# Altium schematic sheet Sheet_1_2022-08-21.schdoc
size 321 x 219 mm
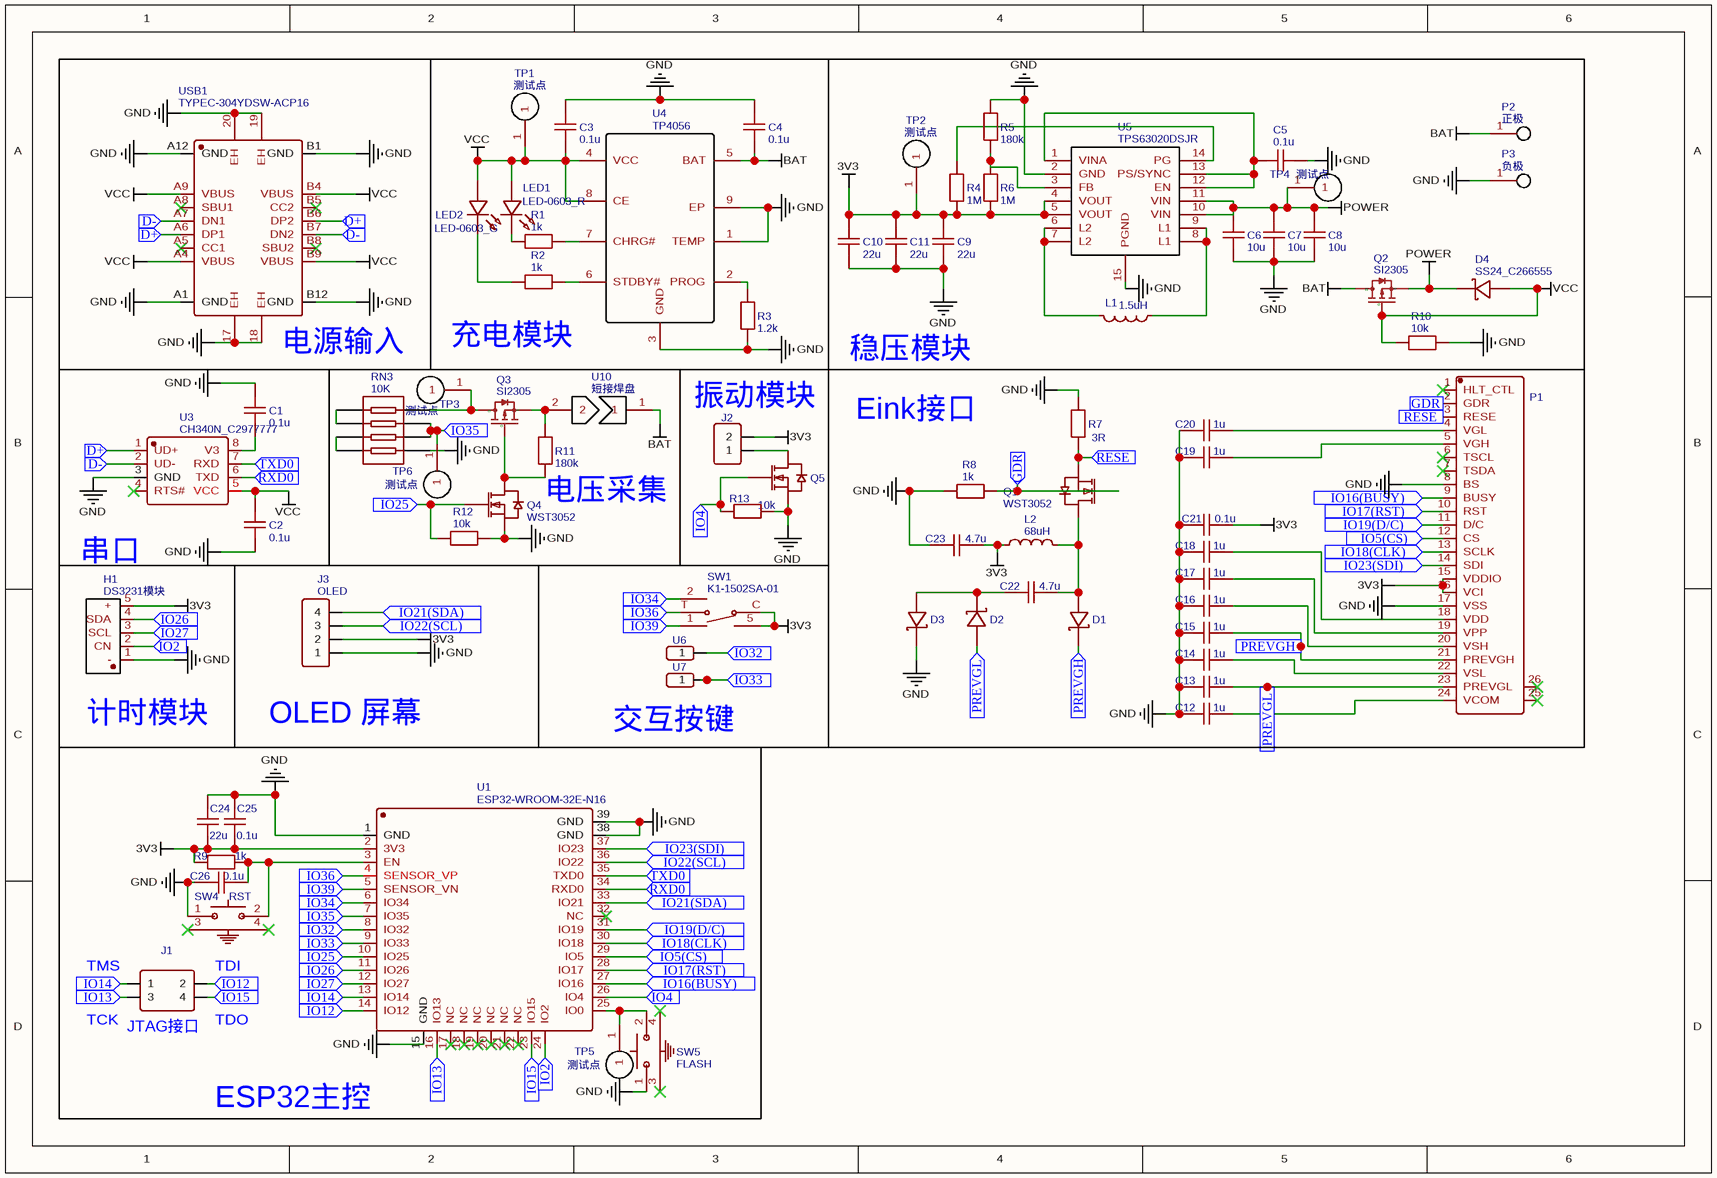
[diagram p0: Sheet_1_2022-08-21.schdoc]

## Parts
C1  0.1u  [C0603]
C2  0.1u  [C0603]
C3  0.1u  [C0603]
C4  0.1u  [C0603]
C5  0.1u  [C0603]
C6  10u  [C0603]
C7  10u  [C0603]
C8  10u  [C0603]
C9  22u  [C0603]
C10  22u  [C0603]
C11  22u  [C0603]
C12  1u  [C0603]
C13  1u  [C0603]
C14  1u  [C0603]
C15  1u  [C0603]
C16  1u  [C0603]
C17  1u  [C0603]
C18  1u  [C0603]
C19  1u  [C0603]
C20  1u  [C0603]
C21  0.1u  [C0603]
C22  4.7u  [C0603]
C23  4.7u  [C0603]
C24  22u  [C0603]
C25  0.1u  [C0603]
C26  0.1u  [C0603]
D1  MBR0530_C232832  [SOD-123_L2.8-W1.8-LS3.7-RD]  (value not drawn)
D2  MBR0530_C232832  [SOD-123_L2.8-W1.8-LS3.7-RD]  (value not drawn)
D3  MBR0530_C232832  [SOD-123_L2.8-W1.8-LS3.7-RD]  (value not drawn)
D4  SS24_C266555  [SMB_L4.6-W3.6-LS5.3-RD]
H1  DS3231模块  [DS3231模块]
J1  HDR-M-2.54_2x2  [HDR-M-2.54_2X2]  (value not drawn)
J2  HDR-M-2.54_1x2  [HDR-M-2.54_1X2]  (value not drawn)
J3  OLED  [HDR-M-2.54_1X4]
L1  1.5uH  [IND-SMD_L4.0-W4.0]
L2  68uH  [IND-SMD_L6.0-W6.0]
LED1  LED-0603_R  [LED0603_RED]
LED2  LED-0603_G  [LED0603_GREEN]
P1  微雪电子 24pin 电子墨水屏幕底座  /FPC 0.5MM 24P  [FPC-SMD_AFC07-S24FCC-00]  (value not drawn)
P2  正极  [电池电极焊盘]
P3  负极  [电池电极焊盘]
Q1  WST3052  [SOT-323-3_L2.1-W1.3-P1.30-LS2.3-BL]
Q2  SI2305  [SOT-23-3_L2.9-W1.3-P1.90-LS2.4-BR]
Q3  SI2305  [SOT-23-3_L2.9-W1.3-P1.90-LS2.4-BR]
Q4  WST3052  [SOT-323-3_L2.1-W1.3-P1.30-LS2.3-BL]
Q5  WST3052  [SOT-323-3_L2.1-W1.3-P1.30-LS2.3-BL]  (value not drawn)
R1  1k  [R0805]
R2  1k  [R0805]
R3  1.2k  [R0603]
R4  1M  [R0603]
R5  180k  [R0603]
R6  1M  [R0603]
R7  3R  [R0603]
R8  1k  [R0603]
R9  1k  [R0805]
R10  10k  [R0603]
R11  180k  [R0603]
R12  10k  [R0603]
R13  10k  [R0603]
RN3  10K  [RES-ARRAY-SMD_0603-8P-L3.2-W1.6-BL]
SW1  K1-1502SA-01  [KEY-SMD_K1-1502SA-01]
SW4  RST  [SW-SMD_1TS002G-XXXX-3500-CT]
SW5  FLASH  [SW-SMD_1TS002G-XXXX-3500-CT]
TP1  测试点  [检测点]
TP2  测试点  [检测点]
TP3  测试点  [检测点]
TP4  测试点  [检测点]
TP5  测试点  [检测点]
TP6  测试点  [检测点]
U1  ESP32-WROOM-32E-N16  [WIFI-SMD_ESP32-WROOM-32E]
U3  CH340N_C2977777  [SOP-8_L4.9-W3.9-P1.27-LS6.0-BL]
U4  TP4056  [ESOP-8_L4.9-W3.9-P1.27-LS6.0-BL-EP]
U5  TPS63020DSJR  [VSON-14_L4.0-W3.0-P0.50-BL-EP_TI_DSJ]
U6  触摸焊盘  [触摸焊盘]  (value not drawn)
U7  触摸焊盘  [触摸焊盘]  (value not drawn)
U10  短接焊盘  [短接焊盘]
USB1  TYPEC-304YDSW-ACP16  [USB-C-SMD_TYPEC-304YDSW-ACP16]

## Blocks framed on the sheet
充电模块: C3 C4 LED1 LED2 R1-R3 TP1 U4
稳压模块: C5-C11 D4 L1 P2 P3 Q2 R4-R6 R10 TP2 TP4 U5
电源输入: C1 C2 U3
Eink接口: C12-C23 D1-D3 L2 P1 Q1 R7 R8
OLED 屏幕: J3
交互按键: SW1 U6 U7

## Ports
D+ (in), D- (in), GDR (in), IO2 (in), IO4 (in), IO5(CS) (in), IO12 (in), IO13 (in), IO14 (in), IO15 (in), IO16(BUSY) (in), IO17(RST) (in), IO18(CLK) (in), IO19(D/C) (in), IO21(SDA) (in), IO22(SCL) (in), IO23(SDI) (in), IO25 (in), IO26 (in), IO27 (in), IO32 (in), IO33 (in), IO34 (in), IO35 (in), IO36 (in), IO39 (in), PREVGH (in), PREVGL (in), RESE (in), RXD0 (in), TXD0 (in)

## Nets
3V3: C9.2 C10.2 C11.2 C21.2 C23.2 C24.1 C25.1 H1.5(+) J2.2 J3.2 L2.1 P1.15(VDDIO) P1.16(VCI) R4.1 R6.1 R9.1 SW1.5 SW1.C TP2.1 U1.2(3V3) U5.4(VOUT) U5.5(VOUT)
BAT: C4.1 P2.1 Q2.3(D) U4.5(BAT) U10.1
GND: C1.2 C2.1 C3.2 C4.2 C5.2 C6.1 C7.1 C8.1 C9.1 C10.1 C11.1 C12.1 C13.1 C14.2 C15.1 C16.1 C17.1 C18.1 C19.1 C20.1 C21.1 C23.1 C24.2 C25.2 C26.2 D3.1(K) H1.1(-) J3.1 P1.8(BS) P1.17(VSS) P3.1 Q4.2(S) Q5.2(S) R3.1 R5.2 R7.2 R8.2 R10.1 R12.2 R13.2 RN3.5 SW4.1 SW5.1 U1.1(GND) U1.15(GND) U1.38(GND) U1.39(GND) U3.3(GND) U4.1(TEMP) U4.3(GND) U4.9(EP) U5.2(GND) U5.15(PGND) USB1.17(EH) USB1.18(EH) USB1.19(EH) USB1.20(EH) USB1.A1(GND) USB1.A12(GND) USB1.B1(GND) USB1.B12(GND)
POWER: C6.2 C7.2 C8.2 D4.1(C) Q2.2(S) TP4.1 U5.10(VIN) U5.11(VIN)
VCC: C2.2 C3.1 D4.2(A) LED1.1 LED2.1 Q2.1(G) R10.2 TP1.1 U3.5(VCC) U4.4(VCC) U4.8(CE) USB1.A4(VBUS) USB1.A9(VBUS) USB1.B4(VBUS) USB1.B9(VBUS)
D+: U3.1(UD+) USB1.A6(DP1) USB1.B6(DP2) ; port D+
D-: U3.2(UD-) USB1.A7(DN1) USB1.B7(DN2) ; port D-
GDR: P1.2(GDR) Q1.1(G) R8.1 ; port GDR
IO2: H1.2(CN) U1.24(IO2) ; port IO2
IO4: Q5.1(G) R13.1 U1.26(IO4) ; port IO4
IO5(CS): P1.12(CS) U1.29(IO5) ; port IO5(CS)
IO12: J1.2 U1.14(IO12) ; port IO12
IO13: J1.3 U1.16(IO13) ; port IO13
IO14: J1.1 U1.13(IO14) ; port IO14
IO15: J1.4 U1.23(IO15) ; port IO15
IO16(BUSY): P1.9(BUSY) U1.27(IO16) ; port IO16(BUSY)
IO17(RST): P1.10(RST) U1.28(IO17) ; port IO17(RST)
IO18(CLK): P1.13(SCLK) U1.30(IO18) ; port IO18(CLK)
IO19(D/C): P1.11(D/C) U1.31(IO19) ; port IO19(D/C)
IO21(SDA): J3.4 U1.33(IO21) ; port IO21(SDA)
IO22(SCL): J3.3 U1.36(IO22) ; port IO22(SCL)
IO23(SDI): P1.14(SDI) U1.37(IO23) ; port IO23(SDI)
IO25: Q4.1(G) R12.1 U1.10(IO25) ; port IO25
IO26: H1.4(SDA) U1.11(IO26) ; port IO26
IO27: H1.3(SCL) U1.12(IO27) ; port IO27
IO32: U1.8(IO32) U6.1 ; port IO32
IO33: U1.9(IO33) U7.1 ; port IO33
IO34: SW1.2 U1.6(IO34) ; port IO34
IO35: RN3.6 RN3.7 TP6.1 U1.7(IO35) ; port IO35
IO36: SW1.T U1.4(SENSOR_VP) ; port IO36
IO39: SW1.1 U1.5(SENSOR_VN) ; port IO39
PREVGH: C15.2 D1.1(K) P1.21(PREVGH) ; port PREVGH
PREVGL: C13.2 D2.2(A) P1.23(PREVGL) ; port PREVGL
RESE: P1.3(RESE) Q1.2(S) R7.1 ; port RESE
RXD0: U1.34(RXD0) U3.6(TXD) ; port RXD0
TXD0: U1.35(TXD0) U3.7(RXD) ; port TXD0
NetC1_1: C1.1 U3.8(V3)
NetC5_1: C5.1 U5.1(VINA) U5.12(EN) U5.13(PS/SYNC)
NetC12_2: C12.2 P1.24(VCOM)
NetC14_1: C14.1 P1.22(VSL)
NetC16_2: C16.2 P1.20(VSH)
NetC17_2: C17.2 P1.19(VPP)
NetC18_2: C18.2 P1.18(VDD)
NetC19_2: C19.2 P1.5(VGH)
NetC20_2: C20.2 P1.4(VGL)
NetC22_1: C22.1 D2.1(K) D3.2(A)
NetC22_2: C22.2 D1.2(A) L2.2 Q1.3(D)
NetC26_1: C26.1 R9.2 SW4.2 U1.3(EN)
NetJ2_1: J2.1 Q5.3(D)
NetL1_1: L1.1 U5.8(L1) U5.9(L1)
NetL1_2: L1.2 U5.6(L2) U5.7(L2)
NetLED1_2: LED1.2 R1.1
NetLED2_2: LED2.2 R2.1
NetQ3_1: Q3.1(G) Q4.3(D) R11.1
NetQ3_2: Q3.2(S) R11.2 U10.2
NetQ3_3: Q3.3(D) RN3.8 TP3.1
NetR1_2: R1.2 U4.7(CHRG#)
NetR2_2: R2.2 U4.6(STDBY#)
NetR3_2: R3.2 U4.2(PROG)
NetR4_2: R4.2 U5.14(PG)
NetR5_1: R5.1 R6.2 U5.3(FB)
NetRN3_1: RN3.1 RN3.2
NetRN3_3: RN3.3 RN3.4
NetSW5_2: SW5.2 TP5.1 U1.25(IO0)

Not connected (* = marked no-connect by the designer): P1 1(HLT_CTL)* 6(TSCL)* 7(TSDA)* 25* 26*; SW4 3* 4*; SW5 3* 4*; U1 17(NC)* 18(NC)* 19(NC)* 20(NC)* 21(NC)* 22(NC)* 32(NC)*; U3 4(RTS#)*; USB1 A5(CC1)* A8(SBU1)* B5(CC2)* B8(SBU2)*

## Notes on the sheet
- (near J2) 振动模块
- (near R11) 电压采集
- 串口
- (near H1) 计时模块
- (near J1) TMS
- TDI
- (near J1) TCK
- (near J1) JTAG接口
- (near J1) TDO
- ESP32主控

## Library data of the parts
C1-C5 C21 C25 C26 = 0.1u: nameAlias: Value(F); Contributor: LCEDA_Lib; spicePre: C; spiceSymbolName: C_0603_US
C6-C8 = 10u: nameAlias: Value(F); Contributor: LCEDA_Lib; spicePre: C; spiceSymbolName: C_0603_US
C9-C11 C24 = 22u: nameAlias: Value(F); Contributor: LCEDA_Lib; spicePre: C; spiceSymbolName: C_0603_US
C12-C20 = 1u: nameAlias: Value(F); Contributor: LCEDA_Lib; spicePre: C; spiceSymbolName: C_0603_US
C22 C23 = 4.7u: nameAlias: Value(F); Contributor: LCEDA_Lib; spicePre: C; spiceSymbolName: C_0603_US
D1-D3 = MBR0530_C232832: BOM_Manufacturer: ON Semicon; Contributor: LCSC; BOM_Supplier: LCSC; BOM_Supplier Part: C232832; BOM_Manufacturer Part: MBR0530; BOM_JLCPCB Part Class: Extended Part; spicePre: D; spiceSymbolName: MBR0530_C232832
D4 = SS24_C266555: BOM_Manufacturer: Bourne Semicon (Shenzhen); BOM_Manufacturer Part: SS24; Contributor: LCSC; BOM_Supplier: LCSC; BOM_Supplier Part: C266555; BOM_JLCPCB Part Class: Extended Part; spicePre: D; spiceSymbolName: SS24_C266555
H1 = DS3231模块: BOM_Manufacturer: XFCN; BOM_Manufacturer Part: PZ254V-11-05P; Contributor: LCSC; BOM_Paste Type: expand; BOM_Supplier: LCSC; BOM_Supplier Part: C492404; spicePre: H; spiceSymbolName: DS3231模块
J1 = HDR-M-2.54_2x2: Contributor: LCEDA_Lib; BOM_Supplier Part: C66690; BOM_Supplier: LCSC; spicePre: J; spiceSymbolName: HDR-M-2.54_2x2
J2 = HDR-M-2.54_1x2: Contributor: LCEDA_Lib; BOM_Supplier Part: C124375; BOM_Supplier: LCSC; spicePre: J; spiceSymbolName: HDR-M-2.54_1x2
J3 = OLED: Contributor: LCEDA_Lib; BOM_Supplier Part: C124378; BOM_Supplier: LCSC; spicePre: J; spiceSymbolName: HDR-M-2.54_1x4
L1 = 1.5uH: BOM_Manufacturer: Sunlord; BOM_Manufacturer Part: ASWPA4035S1R5MT; nameAlias: Inductance; Contributor: LCSC; BOM_Supplier: LCSC; BOM_Supplier Part: C340206; BOM_JLCPCB Part Class: Extended Part; spicePre: L; spiceSymbolName: ASWPA4035S1R5MT
L2 = 68uH: BOM_Manufacturer: Sunlord; BOM_Manufacturer Part: ASWPA6055S680MT; nameAlias: Inductance; Contributor: LCSC; BOM_Supplier: LCSC; BOM_Supplier Part: C340229; BOM_JLCPCB Part Class: Extended Part; spicePre: L; spiceSymbolName: ASWPA6055S680MT
LED1 = LED-0603_R: BOM_Manufacturer: EVERLIGHT(台湾亿光); BOM_Manufacturer Part: 19-217/R6C-AL1M2VY/3T; Contributor: LCEDA_01; BOM_Supplier Part: C72044; BOM_Supplier: LCSC; spicePre: L; spiceSymbolName: LED-0603_R
LED2 = LED-0603_G: BOM_Manufacturer: EVERLIGHT(台湾亿光); BOM_Manufacturer Part: 19-217/GHC-YR1S2/3T; Contributor: LCEDA_Lib; BOM_Supplier Part: C72043; BOM_Supplier: LCSC; spicePre: L; spiceSymbolName: LED-0603_G
P1 = 微雪电子 24pin 电子墨水屏幕底座  /FPC 0.5MM 24P: BOM_Manufacturer: ReliaPro; BOM_Manufacturer Part: FPC 0.5MM 24P Pull type H2.0mm Under the next; Contributor: jszszzy; spicePre: X; BOM_Supplier: LCSC; image: //image.lceda.cn/szlcsc/C11057.jpg; BOM_Supplier Part: C11057; spiceSymbolName: 微雪电子 24pin 电子墨水屏幕底座  /FPC 0.5MM 24P
P2 = 正极: Contributor: Newguy; spicePre: P; spiceSymbolName: 电池焊盘
P3 = 负极: Contributor: Newguy; spicePre: P; spiceSymbolName: 电池焊盘
Q1 Q4 Q5 = WST3052: BOM_Manufacturer: Winsok Semicon; Contributor: LCSC; BOM_Supplier: LCSC; BOM_Supplier Part: C719079; BOM_Manufacturer Part: WST3052; BOM_JLCPCB Part Class: Extended Part; spicePre: Q; spiceSymbolName: WST3052
Q2 Q3 = SI2305: BOM_Manufacturer: Hottech; Contributor: LCSC; SMT Type: Extend; BOM_Supplier: LCSC; BOM_Manufacturer Part: SI2305; BOM_Supplier Part: C181088; BOM_LCSC Assembly: Yes; spicePre: Q; spiceSymbolName: SI2305; BOM_JLCPCB Part Class: Extended Part
R1 R2 R8 R9 = 1k: nameAlias: Value(Ω); Contributor: LCEDA_Lib; spicePre: R
  R1 R2: spiceSymbolName: R_0805_EU
  R8 R9: spiceSymbolName: R_0603_EU
R3 = 1.2k: nameAlias: Value(Ω); Contributor: LCEDA_Lib; spicePre: R; spiceSymbolName: R_0603_EU
R4 R6 = 1M: nameAlias: Value(Ω); Contributor: LCEDA_Lib; spicePre: R; spiceSymbolName: R_0603_EU
R5 R11 = 180k: nameAlias: Value(Ω); Contributor: LCEDA_Lib; spicePre: R; spiceSymbolName: R_0603_EU
R7 = 3R: nameAlias: Value(Ω); Contributor: LCEDA_Lib; spicePre: R; spiceSymbolName: R_0603_EU
R10 R12 R13 = 10k: nameAlias: Value(Ω); Contributor: LCEDA_Lib; spicePre: R; spiceSymbolName: R_0603_EU
RN3 = 10K: BOM_Manufacturer: YAGEO; BOM_Manufacturer Part: YC164-JR-0710KL; nameAlias: Resistance (Ohms); Resistance: 10kΩ; BOM_Supplier: LCSC; BOM_Supplier Part: C107374; BOM_JLCPCB Part Class: Extended Part; spicePre: R; spiceSymbolName: YC164-JR-0710KL
SW1 = K1-1502SA-01: BOM_Manufacturer: Rectangular Connectors - Contacts; Contributor: LCSC; BOM_Supplier: LCSC; BOM_Supplier Part: C145915; BOM_Manufacturer Part: K1-1502SA-01; BOM_JLCPCB Part Class: Extended Part; spicePre: S; spiceSymbolName: K1-1502SA-01
SW4 = RST: BOM_Manufacturer: HYP; BOM_Manufacturer Part: 1TS002G-2500-3500; Contributor: LCSC; BOM_Supplier: LCSC; BOM_Supplier Part: C255804; BOM_JLCPCB Part Class: Extended Part; spicePre: S; spiceSymbolName: 1TS002G-2500-3500
SW5 = FLASH: BOM_Manufacturer: HYP; BOM_Manufacturer Part: 1TS002G-2500-3500; Contributor: LCSC; BOM_Supplier: LCSC; BOM_Supplier Part: C255804; BOM_JLCPCB Part Class: Extended Part; spicePre: S; spiceSymbolName: 1TS002G-2500-3500
TP1-TP6 = 测试点: Contributor: CSSC; spicePre: T; spiceSymbolName: 测试点
U1 = ESP32-WROOM-32E-N16: BOM_Manufacturer: ESPRESSIF 乐鑫; Contributor: lcsc; BOM_Supplier: LCSC; BOM_Supplier Part: C2973650; BOM_Manufacturer Part: ESP32-WROOM-32E-N16; link: https://atta.szlcsc.comnull; spicePre: U; spiceSymbolName: ESP32-WROOM-32E-N16
U3 = CH340N_C2977777: BOM_Manufacturer: WCH(南京沁恒); BOM_Manufacturer Part: CH340N; Contributor: LCSC; BOM_Supplier: LCSC; BOM_Supplier Part: C2977777; BOM_JLCPCB Part Class: Extended Part; spicePre: U; spiceSymbolName: CH340N_C2977777
U4 = TP4056: BOM_Manufacturer: TOPPOWER; Contributor: Guest; BOM_Supplier: LCSC; BOM_Manufacturer Part: TP4056; BOM_Supplier Part: C16581; BOM_JLCPCB Part Class: Basic Part; spicePre: U; spiceSymbolName: TP4056
U5 = TPS63020DSJR: BOM_Manufacturer: TI; BOM_Supplier: LCSC; BOM_Manufacturer Part: TPS63020DSJR; BOM_Supplier Part: C15483; BOM_JLCPCB Part Class: Extended Part; spicePre: U; spiceSymbolName: TPS63020DSJR
U6 U7 = 触摸焊盘: Contributor: goodwood; spicePre: U; spiceSymbolName: 触摸焊盘
U10 = 短接焊盘: Contributor: laimoren; spicePre: U; spiceSymbolName: 短接焊盘
USB1 = TYPEC-304YDSW-ACP16: BOM_Manufacturer: XUNPU(讯普); Contributor: LCSC; BOM_Supplier: LCSC; BOM_Supplier Part: C2840391; BOM_Manufacturer Part: TYPEC-304YDSW-ACP16; spicePre: U; spiceSymbolName: TYPEC-304YDSW-ACP16